# Altium schematic sheet TRACKER.SchDoc
size B; DocumentNumber: 1; SheetNumber: 1; SheetTotal: 1; PageSetup: Record=PageOptions|CenterHorizontal=True|CenterVertical=True|PrintScale=0.72|XCorrection=1.00|YCorrection=1.00|PrintKind=1|BorderSize=5000000|LeftOffset=0|BottomOffset=0|Orientation=2|PaperLength=1000|PaperWidth=1000|Scale=100|PaperSource=15|PrintQuality=1200|MediaType=1|DitherType=0|PaperKind=Letter|PrintScaleMode=1
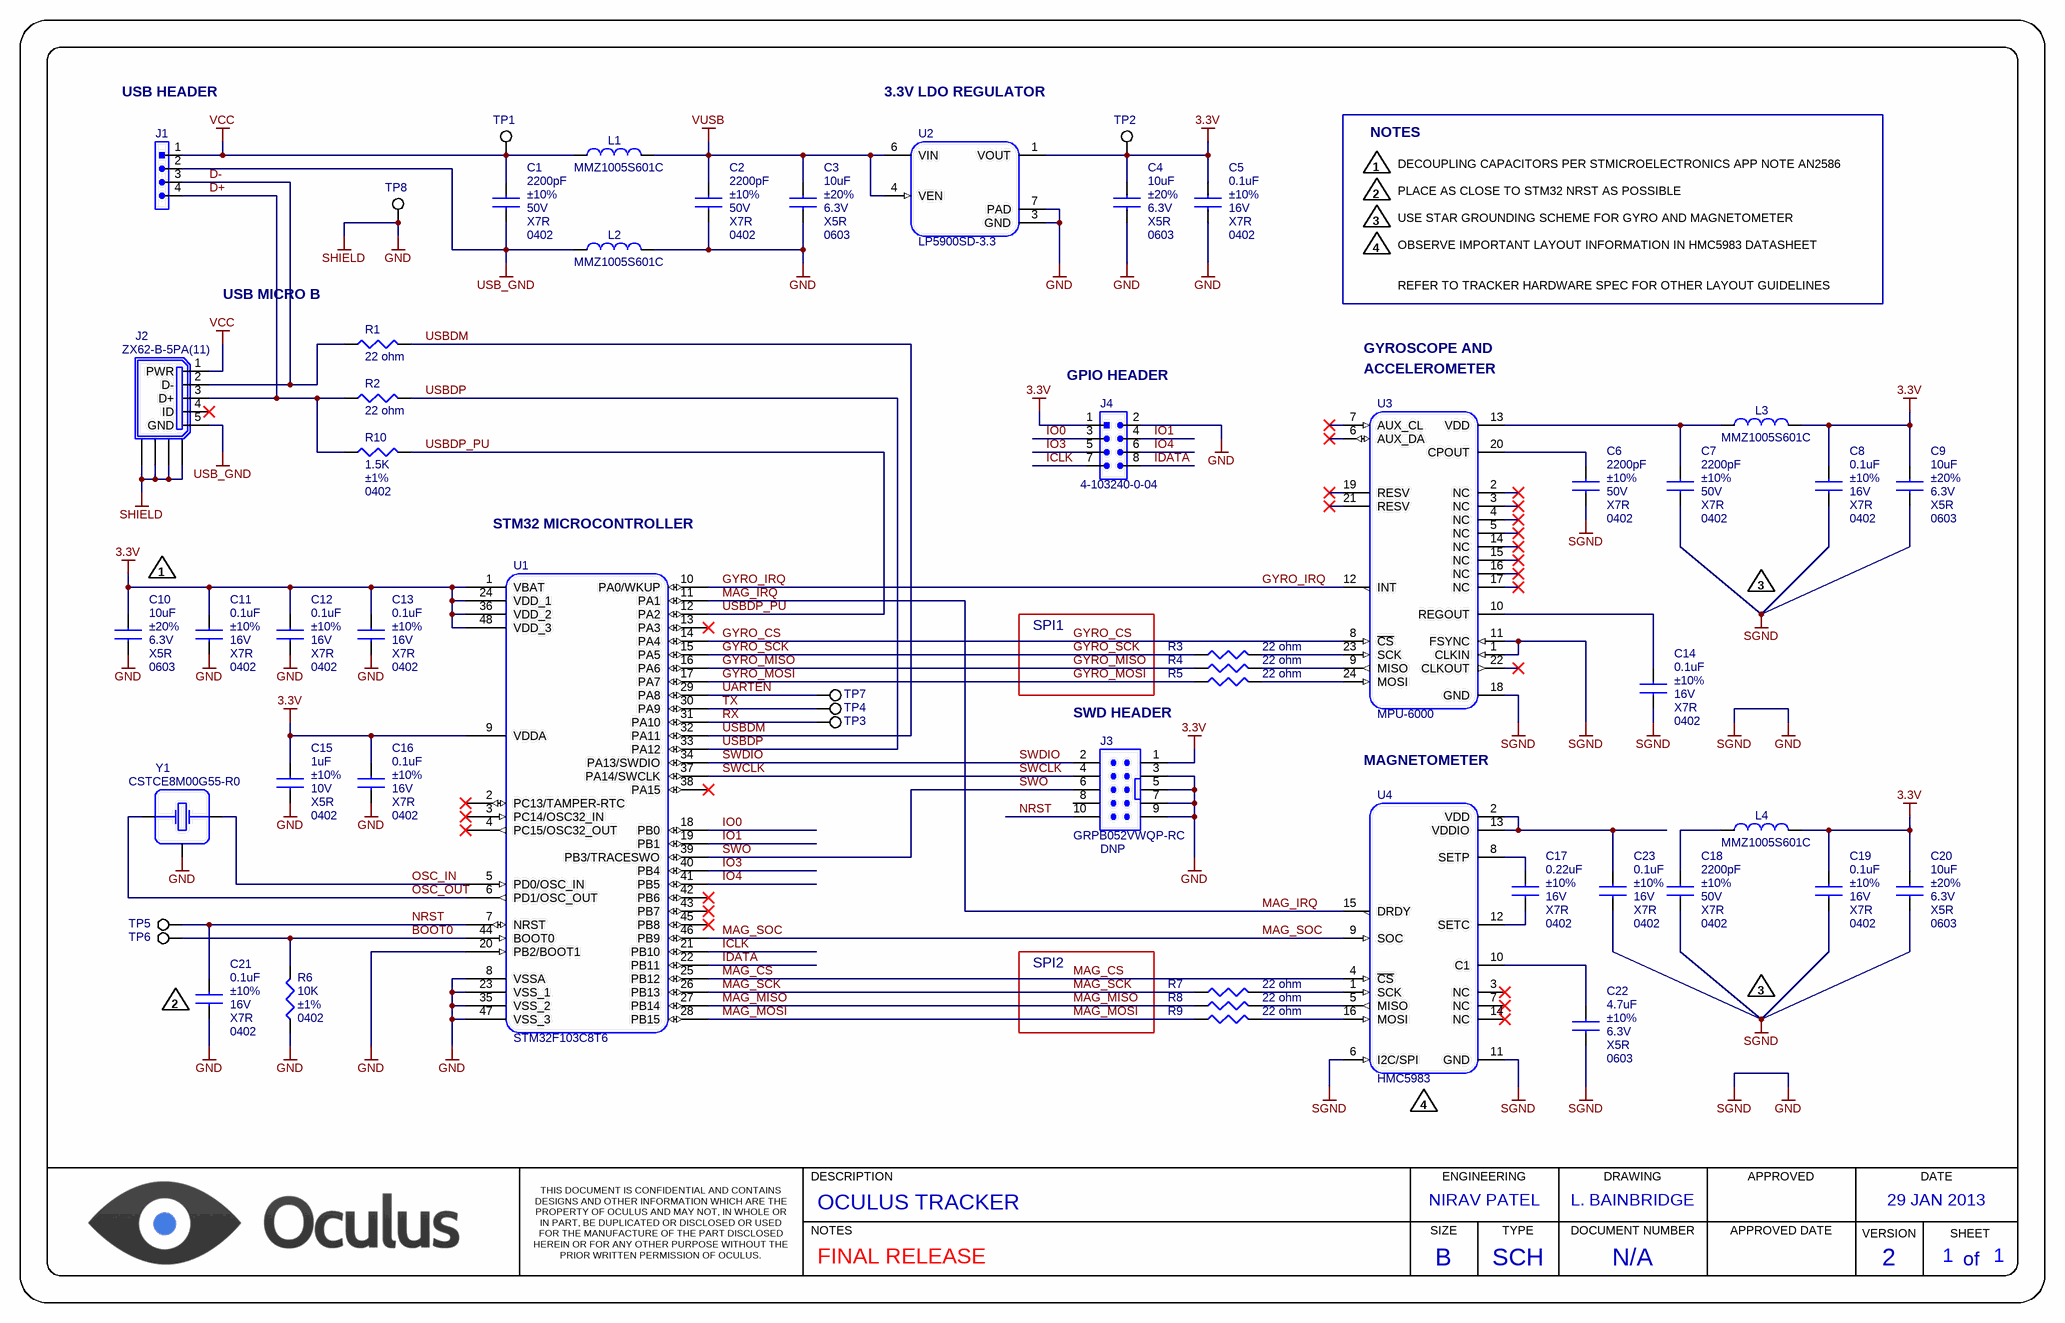
[diagram p0: TRACKER.SchDoc]

## Parts
C1  2200pF  Tolerance: ±10%  Voltage: 50V  Dielectric: X7R  Package: 0402  [CAP_CERAMIC_0402]
C2  2200pF  Tolerance: ±10%  Voltage: 50V  Dielectric: X7R  Package: 0402  [CAP_CERAMIC_0402]
C3  10uF  Tolerance: ±20%  Voltage: 6.3V  Dielectric: X5R  Package: 0603  [CAP_CERAMIC_0603]
C4  10uF  Tolerance: ±20%  Voltage: 6.3V  Dielectric: X5R  Package: 0603  [CAP_CERAMIC_0603]
C5  0.1uF  Tolerance: ±10%  Voltage: 16V  Dielectric: X7R  Package: 0402  [CAP_CERAMIC_0402]
C6  2200pF  Tolerance: ±10%  Voltage: 50V  Dielectric: X7R  Package: 0402  [CAP_CERAMIC_0402]
C7  2200pF  Tolerance: ±10%  Voltage: 50V  Dielectric: X7R  Package: 0402  [CAP_CERAMIC_0402]
C8  0.1uF  Tolerance: ±10%  Voltage: 16V  Dielectric: X7R  Package: 0402  [CAP_CERAMIC_0402]
C9  10uF  Tolerance: ±20%  Voltage: 6.3V  Dielectric: X5R  Package: 0603  [CAP_CERAMIC_0603]
C10  10uF  Tolerance: ±20%  Voltage: 6.3V  Dielectric: X5R  Package: 0603  [CAP_CERAMIC_0603]
C11  0.1uF  Tolerance: ±10%  Voltage: 16V  Dielectric: X7R  Package: 0402  [CAP_CERAMIC_0402]
C12  0.1uF  Tolerance: ±10%  Voltage: 16V  Dielectric: X7R  Package: 0402  [CAP_CERAMIC_0402]
C13  0.1uF  Tolerance: ±10%  Voltage: 16V  Dielectric: X7R  Package: 0402  [CAP_CERAMIC_0402]
C14  0.1uF  Tolerance: ±10%  Voltage: 16V  Dielectric: X7R  Package: 0402  [CAP_CERAMIC_0402]
C15  1uF  Tolerance: ±10%  Voltage: 10V  Dielectric: X5R  Package: 0402  [CAP_CERAMIC_0402]
C16  0.1uF  Tolerance: ±10%  Voltage: 16V  Dielectric: X7R  Package: 0402  [CAP_CERAMIC_0402]
C17  0.22uF  Tolerance: ±10%  Voltage: 16V  Dielectric: X7R  Package: 0402  [CAP_CERAMIC_0402]
C18  2200pF  Tolerance: ±10%  Voltage: 50V  Dielectric: X7R  Package: 0402  [CAP_CERAMIC_0402]
C19  0.1uF  Tolerance: ±10%  Voltage: 16V  Dielectric: X7R  Package: 0402  [CAP_CERAMIC_0402]
C20  10uF  Tolerance: ±20%  Voltage: 6.3V  Dielectric: X5R  Package: 0603  [CAP_CERAMIC_0603]
C21  0.1uF  Tolerance: ±10%  Voltage: 16V  Dielectric: X7R  Package: 0402  [CAP_CERAMIC_0402]
C22  4.7uF  Tolerance: ±10%  Voltage: 6.3V  Dielectric: X5R  Package: 0603  [CAP_CERAMIC_0603]
C23  0.1uF  Tolerance: ±10%  Voltage: 16V  Dielectric: X7R  Package: 0402  [CAP_CERAMIC_0402]
J1  USB_HEADER  [USB_HEADER]  (value not drawn)
J2  ZX62-B-5PA(11)  [ZX62-B-5PA(11)]
J3  GRPB052VWQP-RC  [GRPB052VWQP-RC]
J4  4-103240-0-04  [4-103240-0-04]
L1  MMZ1005S601C  [INDUCTOR_0402]
L2  MMZ1005S601C  [INDUCTOR_0402]
L3  MMZ1005S601C  [INDUCTOR_0402]
L4  MMZ1005S601C  [INDUCTOR_0402]
R1  22 ohm  [RESISTOR_0402]
R2  22 ohm  [RESISTOR_0402]
R3  22 ohm  [RESISTOR_0402]
R4  22 ohm  [RESISTOR_0402]
R5  22 ohm  [RESISTOR_0402]
R6  10K  Package: 0402  Tolerance: ±1%  [RESISTOR_0402]
R7  22 ohm  [RESISTOR_0402]
R8  22 ohm  [RESISTOR_0402]
R9  22 ohm  [RESISTOR_0402]
R10  1.5K  Package: 0402  Tolerance: ±1%  [RESISTOR_0402]
TP1  TEST POINT  [TEST_POINT_PAD]  (value not drawn)  (no BOM)
TP2  TEST POINT  [TEST_POINT_PAD]  (value not drawn)  (no BOM)
TP3  TEST POINT  [TEST_POINT_PAD]  (value not drawn)  (no BOM)
TP4  TEST POINT  [TEST_POINT_PAD]  (value not drawn)  (no BOM)
TP5  TEST POINT  [TEST_POINT_PAD]  (value not drawn)  (no BOM)
TP6  TEST POINT  [TEST_POINT_PAD]  (value not drawn)  (no BOM)
TP7  TEST POINT  [TEST_POINT_PAD]  (value not drawn)  (no BOM)
TP8  TEST POINT  [TEST_POINT_PAD]  (value not drawn)  (no BOM)
U1  STM32F103C8T6  [LQFP48]
U2  LP5900SD-3.3  [LLP-6]
U3  MPU-6000  [QFN-24]
U4  HMC5983  [LPCC-16]
Y1  CSTCE8M00G55-R0  [CSTCE]

## Nets
3.3V: C4.1 C5.1 C8.1 C9.1 C10.1 C11.1 C12.1 C13.1 C15.1 C16.1 C19.1 C20.1 J3.1 J4.1 L3.2 L4.2 TP2.1 U1.1(VBAT) U1.9(VDDA) U1.24(VDD_1) U1.36(VDD_2) U1.48(VDD_3) U2.1(VOUT)
GND: C2.2 C3.2 C4.2 C5.2 C6.2 C7.2 C8.2 C9.2 C10.2 C11.2 C12.2 C13.2 C14.2 C15.2 C16.2 C18.2 C19.2 C20.2 C21.2 C22.2 C23.2 J2.6(SHIELD) J2.7(SHIELD) J2.8(SHIELD) J2.9(SHIELD) J3.3 J3.5 J3.7 J3.9 J4.2 L2.2 R6.1 TP8.1 U1.8(VSSA) U1.20(PB2/BOOT1) U1.23(VSS_1) U1.35(VSS_2) U1.47(VSS_3) U2.3(GND) U2.7(PAD) U3.1(CLKIN) U3.11(FSYNC) U3.18(GND) U4.6(I2C/SPI) U4.11(GND) Y1.2(GND)  [also labelled SGND, SHIELD]
USB_GND: C1.2 J1.2 J2.5(GND) L2.1
VCC: C1.1 J1.1 J2.1(PWR) L1.1 TP1.1
VUSB: C2.1 C3.1 L1.2 U2.4(VEN) U2.6(VIN)
BOOT0: R6.2 TP6.1 U1.44(BOOT0)
D+: J1.4 J2.3(D+) R2.1 R10.1
D-: J1.3 J2.2(D-) R1.1
GYRO_CS: U1.14(PA4) U3.8(~{CS})
GYRO_IRQ: U1.10(PA0/WKUP) U3.12(INT)
GYRO_MISO: R4.1 U1.16(PA6)
GYRO_MOSI: R5.1 U1.17(PA7)
GYRO_SCK: R3.1 U1.15(PA5)
ICLK: J4.7 U1.21(PB10)
IDATA: J4.8 U1.22(PB11)
IO0: J4.3 U1.18(PB0)
IO1: J4.4 U1.19(PB1)
IO3: J4.5 U1.40(PB4)
IO4: J4.6 U1.41(PB5)
MAG_CS: U1.25(PB12) U4.4(~{CS})
MAG_IRQ: U1.11(PA1) U4.15(DRDY)
MAG_MISO: R8.1 U1.27(PB14)
MAG_MOSI: R9.1 U1.28(PB15)
MAG_SCK: R7.1 U1.26(PB13)
MAG_SOC: U1.46(PB9) U4.9(SOC)
NRST: C21.1 J3.10 TP5.1 U1.7(NRST)
OSC_IN: U1.5(PD0/OSC_IN) Y1.3
OSC_OUT: U1.6(PD1/OSC_OUT) Y1.1
RX: TP3.1 U1.31(PA10)
SWCLK: J3.4 U1.37(PA14/SWCLK)
SWDIO: J3.2 U1.34(PA13/SWDIO)
SWO: J3.6 U1.39(PB3/TRACESWO)
TX: TP4.1 U1.30(PA9)
UARTEN: TP7.1 U1.29(PA8)
USBDM: R1.2 U1.32(PA11)
USBDP: R2.2 U1.33(PA12)
USBDP_PU: R10.2 U1.12(PA2)
NetC6_1: C6.1 U3.20(CPOUT)
NetC7_1: C7.1 L3.1 U3.13(VDD)
NetC14_1: C14.1 U3.10(REGOUT)
NetC17_1: C17.1 U4.8(SETP)
NetC17_2: C17.2 U4.12(SETC)
NetC18_1: C18.1 L4.1
NetC22_1: C22.1 U4.10(C1)
NetC23_1: C23.1 U4.2(VDD) U4.13(VDDIO)
NetR3_2: R3.2 U3.23(SCK)
NetR4_2: R4.2 U3.9(MISO)
NetR5_2: R5.2 U3.24(MOSI)
NetR7_2: R7.2 U4.1(SCK)
NetR8_2: R8.2 U4.5(MISO)
NetR9_2: R9.2 U4.16(MOSI)

Not connected (* = marked no-connect by the designer): J2 4(ID)*; J3 8; U1 2(PC13/TAMPER-RTC)* 3(PC14/OSC32_IN)* 4(PC15/OSC32_OUT)* 13(PA3)* 38(PA15)* 42(PB6)* 43(PB7)* 45(PB8)*; U3 2(NC)* 3(NC)* 4(NC)* 5(NC)* 6(AUX_DA)* 7(AUX_CL)* 14(NC)* 15(NC)* 16(NC)* 17(NC)* 19(RESV)* 21(RESV)* 22(CLKOUT)*; U4 3(NC)* 7(NC)* 14(NC)*

## Notes on the sheet
- USB HEADER
- 3.3V LDO REGULATOR
- 1
- NOTES
- DECOUPLING CAPACITORS PER STMICROELECTRONICS APP NOTE AN2586
- 2
- 3
- 4
- PLACE AS CLOSE TO STM32 NRST AS POSSIBLE
- USE STAR GROUNDING SCHEME FOR GYRO AND MAGNETOMETER
- OBSERVE IMPORTANT LAYOUT INFORMATION IN HMC5983 DATASHEET
- USB MICRO B
- REFER TO TRACKER HARDWARE SPEC FOR OTHER LAYOUT GUIDELINES
- (near J4) GPIO HEADER
- GYROSCOPE AND
- (near U3) ACCELEROMETER
- STM32 MICROCONTROLLER
- SPI1
- (near J3) SWD HEADER
- MAGNETOMETER
- SPI2
- (near C21) 2
- (near U4) 4
- DESCRIPTION
- ENGINEERING
- DRAWING
- APPROVED
- DATE
- OCULUS TRACKER
- NIRAV PATEL
- SIZE
- TYPE
- L. BAINBRIDGE
- DOCUMENT NUMBER
- APPROVED DATE
- VERSION
- 29 JAN 2013
- SHEET
- of
- THIS DOCUMENT IS CONFIDENTIAL AND CONTAINS DESIGNS AND OTHER INFORMATION WHICH ARE THE PROPERTY OF OCULUS AND MAY NOT, IN WHOLE OR IN PART, BE DUPLICATED OR DISCLOSED OR USED FOR THE MANUFACTURE OF THE PART DISCLOSED HEREIN OR FOR ANY OTHER PURPOSE WITHOUT THE PRIOR WRITTEN PERMISSION OF OCULUS.
- FINAL RELEASE
- B
- SCH
- N/A

## Library data of the parts
C1 C2 C6 C7 C18 = CAP, CERAMIC: CAP, CERAMIC, 2200pF, ±10%, 50V, X7R, 0402; Manufacturer: MURATA ELECTRONICS; Part Number: GRM155R71H222KA01D
C3 C4 C9 C10 C20 = CAP, CERAMIC: CAP, CERAMIC, 10uF, ±20%, 6.3V, X5R, 0603; Manufacturer: MURATA ELECTRONICS; Part Number: GRM188R60J106ME47D
C5 C8 C11-C14 C16 C19 C21 C23 = CAP, CERAMIC: CAP, CERAMIC, 0.1uF, ±10%, 16V, X7R, 0402; Manufacturer: MURATA ELECTRONICS; Part Number: GRM155R71C104KA88D
C15 = CAP, CERAMIC: CAP, CERAMIC, 1uF, ±10%, 10V, X5R, 0402; Manufacturer: MURATA ELECTRONICS; Part Number: GRM155R61A105KE15D
C17 = CAP, CERAMIC: CAP, CERAMIC, 0.22uF, ±10%, 16V, X7R, 0402; Manufacturer: MURATA ELECTRONICS; Part Number: GRM155R71C224KA12D
C22 = CAP, CERAMIC: CAP, CERAMIC, 4.7uF, ±10%, 6.3V, X5R, 0603; Manufacturer: MURATA ELECTRONICS; Part Number: GRM188R60J475KE19D
J1 = USB_HEADER: CONNECTOR, HEADER, 4 POS; Manufacturer: TBD; Part Number: TBD
J2 = ZX62-B-5PA(11): CONNECTOR, USB MICRO B, R/A, SMD; Manufacturer: HIROSE; Part Number: ZX62-B-5PA(11)
J3 = GRPB052VWQP-RC: CONNECTOR, 10 POS, ARM CORTEX SWD HEADER; Manufacturer: SULLINS CONNECTOR; Part Number: GRPB052VWQP-RC; DNP: DNP
J4 = 4-103240-0-04: CONNECTOR, HEADER, 2X4, 0.1" PITCH; Manufacturer: TE CONNECTIVITY; Part Number: 4-103240-0-04; Pitch: 0.1"
L1-L4 = INDUCTOR: FERRITE CHIP BEAD, 600 OHM @ 100MHz, 300mA, 0402; Manufacturer: TDK CORPORATION; Part Number: MMZ1005S601C; Package: 0402
R1-R5 R7-R9 = RESISTOR: RES, 22 OHM, 1/10W, ±1%, 0402; Manufacturer: PANASONIC; Part Number: ERJ-2RKF22R0X; Power Rating: 1/10W; Package: 0402; Tolerance: ±1%
R6 = RESISTOR: RES, 10K OHM, 1/10W, ±1%, 0402; Manufacturer: PANASONIC; Part Number: ERJ-2RKF1002X; Power Rating: 1/10W
R10 = RESISTOR: RES, 1.5K OHM, 1/10W, ±1%, 0402; Manufacturer: PANASONIC; Part Number: ERJ-2RKF1501X; Power Rating: 1/10W
TP1-TP8 = TEST_POINT: Manufacturer: *; Part Number: *
U1 = STM32F103C8T6: IC, STM32 MICROCONTROLLER, ARM CORTEX M3; Manufacturer: ST MICROELECTRONICS; Part Number: STM32F103C8T6; Verified Pinout: *
U2 = LP5900SD-3.3: IC, LINEAR REGULATOR, 3.3V, 150MA, ULTRA LOW NOISE; Manufacturer: NATIONAL SEMICONDUCTOR; Part Number: LP5900SD-3.3/NOPB; Pinout verified: *
U3 = MPU-6000: IC, MEMS 3 AXIS GYROSCOPE AND 3 AXIS ACCELEROMETER; Manufacturer: INVENSENSE; Part Number: MPU-6000; Verified Pinout: *; Updated: *
U4 = HMC5983: IC, MEMS 3 AXIS MAGNETOMETER; Manufacturer: HONEYWELL; Part Number: HMC5983-TR; Verified Pinout: *; Updated: *
Y1 = CSTCE8M00G55-R0: CERAMIC RESONATOR, 8MHz, +/-0.2%, 33pF, SMD; Manufacturer: MURATA ELECTRONICS; Part Number: CSTCE8M00G55-R0; Pinout Verified: *